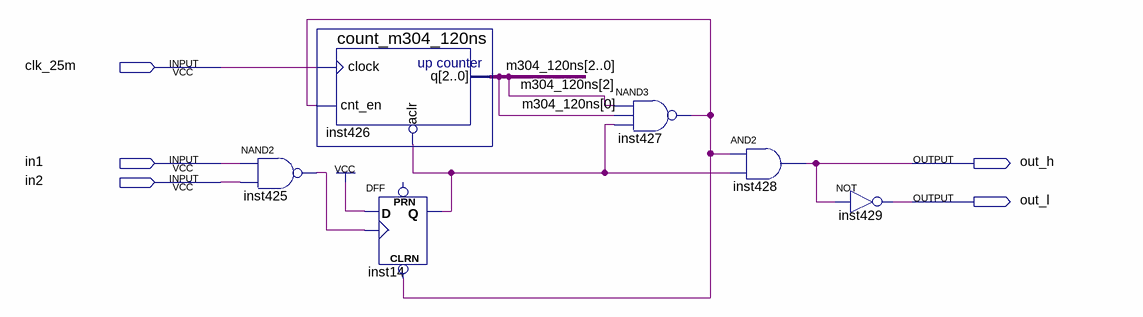
[diagram p0: schematic sheet]
// Quartus schematic m304-120ns.bdf as structural Verilog: 6 symbols, 5 pins
module \m304-120ns  (
  input  clk_25m,
  input  in1,
  input  in2,
  output out_h,
  output out_l
);

  wire inst14_q, inst425_out, inst427_out;
  wire [2:0] m304_120ns;

  nand inst425 (inst425_out, in1, in2);
  count_m304_120ns inst426 (.aclr(~inst14_q), .clock(clk_25m), .cnt_en(inst427_out), .q(m304_120ns));
  DFF inst14 (.CLRN(inst427_out), .CLK(inst425_out), .D(1'b1), .Q(inst14_q));  // open: PRN
  nand inst427 (inst427_out, m304_120ns[2], m304_120ns[0], inst14_q);
  and inst428 (out_h, inst427_out, inst14_q);
  not inst429 (out_l, out_h);
endmodule
